# Altium schematic sheet Power-Management.SchDoc: Power Management
size OrCAD B; DrawnBy: Fred Vatnsdal
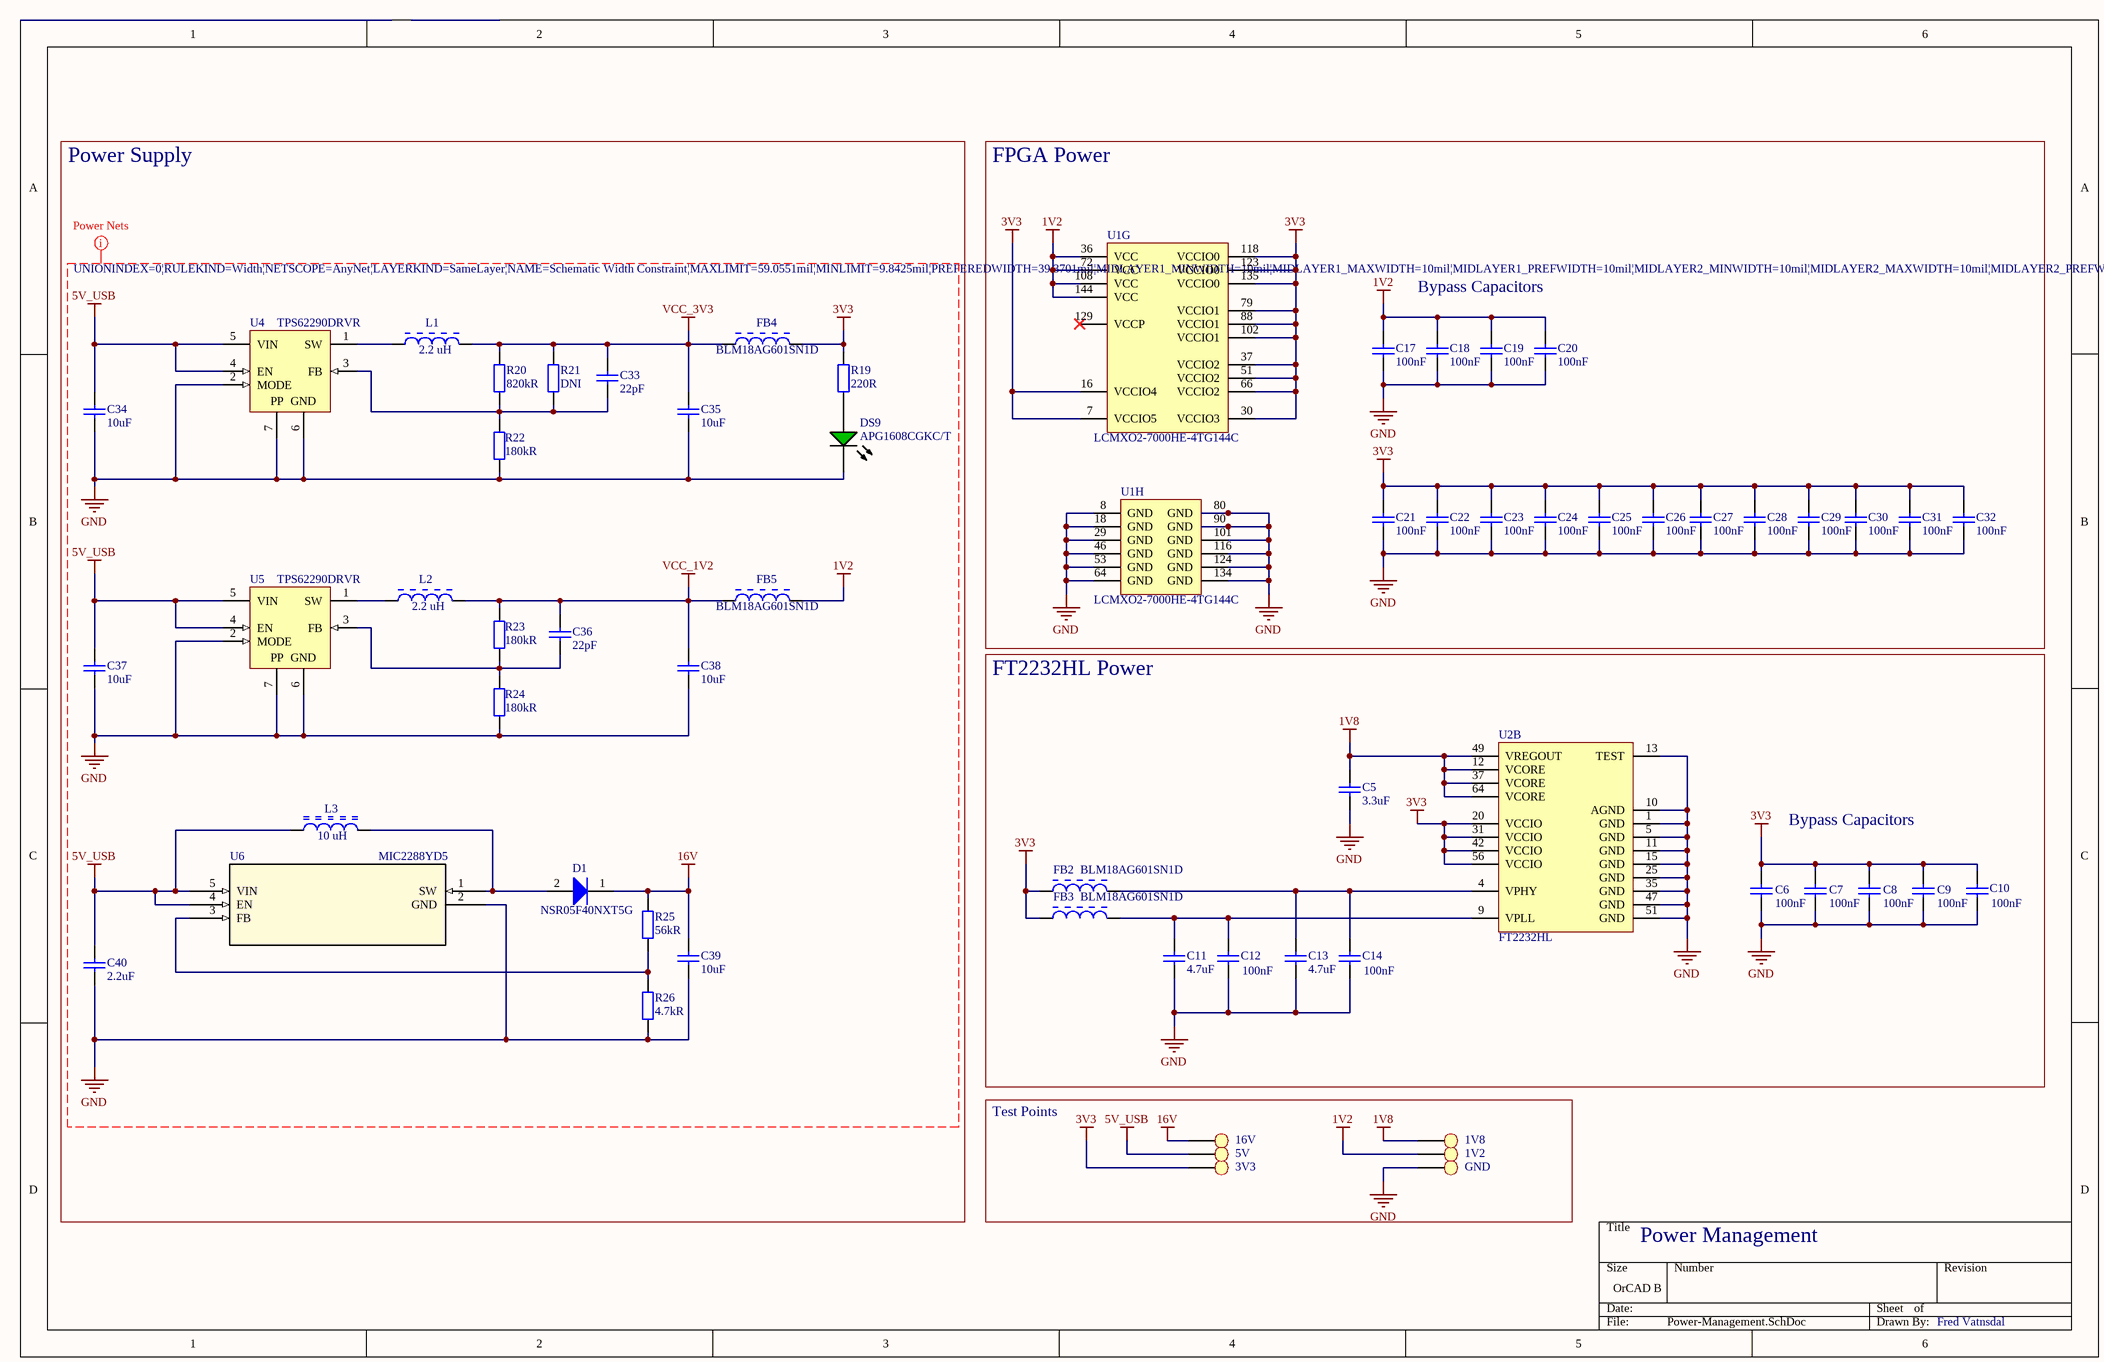
[diagram p0: Power-Management.SchDoc]

## Parts
1V2  TP  [TP_0.75DIA]  (value not drawn)
1V8  TP  [TP_0.75DIA]  (value not drawn)
3V3  TP  [TP_0.75DIA]  (value not drawn)
5V  TP  [TP_0.75DIA]  (value not drawn)
16V  TP  [TP_0.75DIA]  (value not drawn)
C5  Capacitance: 3.3uF  [CAP_0603_imperial]  (hidden comment: CAP 3.3uF 10V 0603(1608))
C6  Capacitance: 100nF  [CAP_0402_imperial]  (hidden comment: C0402C104K4RAC-TU)
C7  Capacitance: 100nF  [CAP_0402_imperial]  (hidden comment: C0402C104K4RACTU)
C8  Capacitance: 100nF  [CAP_0402_imperial]  (hidden comment: C0402C104K4RACTU)
C9  Capacitance: 100nF  [CAP_0402_imperial]  (hidden comment: C0402C104K4RACTU)
C10  Capacitance: 100nF  [CAP_0402_imperial]  (hidden comment: C0402C104K4RACTU)
C11  Capacitance: 4.7uF  [CAP_0603_imperial]  (hidden comment: CAP 4.7uF 10V 0805(2012))
C12  Capacitance: 100nF  [CAP_0402_imperial]  (hidden comment: C0402C104K4RACTU)
C13  Capacitance: 4.7uF  [CAP_0603_imperial]  (hidden comment: CAP 4.7uF 10V 0805(2012))
C14  Capacitance: 100nF  [CAP_0402_imperial]  (hidden comment: C0402C104K4RACTU)
C17  Capacitance: 100nF  [CAP_0402_imperial]  (hidden comment: C0402C104K4RACTU)
C18  Capacitance: 100nF  [CAP_0402_imperial]  (hidden comment: C0402C104K4RACTU)
C19  Capacitance: 100nF  [CAP_0402_imperial]  (hidden comment: C0402C104K4RACTU)
C20  Capacitance: 100nF  [CAP_0402_imperial]  (hidden comment: C0402C104K4RACTU)
C21  Capacitance: 100nF  [CAP_0402_imperial]  (hidden comment: C0402C104K4RACTU)
C22  Capacitance: 100nF  [CAP_0402_imperial]  (hidden comment: C0402C104K4RACTU)
C23  Capacitance: 100nF  [CAP_0402_imperial]  (hidden comment: C0402C104K4RACTU)
C24  Capacitance: 100nF  [CAP_0402_imperial]  (hidden comment: C0402C104K4RACTU)
C25  Capacitance: 100nF  [CAP_0402_imperial]  (hidden comment: C0402C104K4RACTU)
C26  Capacitance: 100nF  [CAP_0402_imperial]  (hidden comment: C0402C104K4RACTU)
C27  Capacitance: 100nF  [CAP_0402_imperial]  (hidden comment: C0402C104K4RACTU)
C28  Capacitance: 100nF  [CAP_0402_imperial]  (hidden comment: C0402C104K4RACTU)
C29  Capacitance: 100nF  [CAP_0402_imperial]  (hidden comment: C0402C104K4RACTU)
C30  Capacitance: 100nF  [CAP_0402_imperial]  (hidden comment: C0402C104K4RACTU)
C31  Capacitance: 100nF  [CAP_0402_imperial]  (hidden comment: C0402C104K4RACTU)
C32  Capacitance: 100nF  [CAP_0402_imperial]  (hidden comment: C0402C104K4RACTU)
C33  Capacitance: 22pF  [CAP_0603_imperial]  (hidden comment: 06035A220JAT2A)
C34  Capacitance: 10uF  [CAP_0603_imperial]  (hidden comment: GRM31CR61E106KA12L)
C35  Capacitance: 10uF  [CAP_0603_imperial]  (hidden comment: GRM31CR61E106KA12L)
C36  Capacitance: 22pF  [CAP_0603_imperial]  (hidden comment: 06035A220JAT2A)
C37  Capacitance: 10uF  [CAP_0603_imperial]  (hidden comment: GRM31CR61E106KA12L)
C38  Capacitance: 10uF  [CAP_0603_imperial]  (hidden comment: GRM31CR61E106KA12L)
C39  Capacitance: 10uF  [CAP_0603_imperial]  (hidden comment: GRM31CR61E106KA12L)
C40  Capacitance: 2.2uF  [CAP_0603_imperial]  (hidden comment: GRM188R61A225KE34x)
D1  NSR05F40NXT5G  [ONSC-DSN-2-152AC-01_V]
DS9  APG1608CGKC/T  [KING-LED0603-25-GREEN_V]
FB2  BLM18AG601SN1D  [MURA-BLM18-F-H1-CHIP-2_V]
FB3  BLM18AG601SN1D  [MURA-BLM18-F-H1-CHIP-2_V]
FB4  BLM18AG601SN1D  [MURA-BLM18-F-H1-CHIP-2_V]
FB5  BLM18AG601SN1D  [MURA-BLM18-F-H1-CHIP-2_V]
GND  TP  [TP_0.75DIA]  (value not drawn)
L1  Inductance: 2.2 uH  [BOUR-SRN3015-2_V]  (hidden comment: SRN3015-2R2M)
L2  Inductance: 2.2 uH  [BOUR-SRN3015-2_V]  (hidden comment: SRN3015-2R2M)
L3  Inductance: 10 uH  [BOUR-CM322522_V]  (hidden comment: CM322522-100KL)
R19  Resistance: 220R  [RES_0603_imperial]  (hidden comment: 220R 1% 0603(1608))
R20  Resistance: 820kR  [RES_0603_imperial]  (hidden comment: 820K 1% 0603(1608))
R21  Resistance: DNI  [RES_0603_imperial]  (hidden comment: 820K 1% 0603(1608))
R22  Resistance: 180kR  [RES_0603_imperial]  (hidden comment: 180K 1% 0603(1608))
R23  Resistance: 180kR  [RES_0603_imperial]  (hidden comment: 180K 1% 0603(1608))
R24  Resistance: 180kR  [RES_0603_imperial]  (hidden comment: 180K 1% 0603(1608))
R25  Resistance: 56kR  [RES_0603_imperial]  (hidden comment: 56K 1% 0603(1608))
R26  Resistance: 4.7kR  [RES_0603_imperial]  (hidden comment: 4K7 1% 0603(1608))
U1  LCMXO2-7000HE-4TG144C  [TQFP144_L]  (parts G,H of 8)
U2  FT2232HL  [FTDI-LQFP-64_L]  (part B of 2)
U4  TPS62290DRVR  [DRV6-1600X1000TP]
U5  TPS62290DRVR  [DRV6-1600X1000TP]
U6  MIC2288YD5  [TSOT-23-5_D5]

## Blocks framed on the sheet
Power Supply: C33-C40 D1 DS9 FB4 FB5 L1-L3 R19-R26 U4-U6
FPGA Power: C17-C32 U1
FT2232HL Power: C5-C14 FB2 FB3 U2
Test Points: 1V2 1V8 3V3 5V 16V GND

## Nets
1V2: 1V2.1 C17.1 C18.1 C19.1 C20.1 FB5.2 U1.36(VCC) U1.72(VCC) U1.108(VCC) U1.144(VCC)
1V8: 1V8.1 C5.1 U2.12(VCORE) U2.37(VCORE) U2.49(VREGOUT) U2.64(VCORE)
3V3: 3V3.1 C6.1 C7.1 C8.1 C9.1 C10.1 C21.1 C22.1 C23.1 C24.1 C25.1 C26.1 C27.1 C28.1 C29.1 C30.1 C31.1 C32.1 FB2.1 FB3.1 FB4.2 R19.2 U1.7(VCCIO5) U1.16(VCCIO4) U1.30(VCCIO3) U1.37(VCCIO2) U1.51(VCCIO2) U1.66(VCCIO2) U1.79(VCCIO1) U1.88(VCCIO1) U1.102(VCCIO1) U1.118(VCCIO0) U1.123(VCCIO0) U1.135(VCCIO0) U2.20(VCCIO) U2.31(VCCIO) U2.42(VCCIO) U2.56(VCCIO)
5V_USB: 5V.1 C34.1 C37.1 C40.1 L3.1 U4.4(EN) U4.5(VIN) U5.4(EN) U5.5(VIN) U6.4(EN) U6.5(VIN)
16V: 16V.1 C39.1 D1.1(K) R25.2
GND: C5.2 C6.2 C7.2 C8.2 C9.2 C10.2 C11.2 C12.2 C13.2 C14.2 C17.2 C18.2 C19.2 C20.2 C21.2 C22.2 C23.2 C24.2 C25.2 C26.2 C27.2 C28.2 C29.2 C30.2 C31.2 C32.2 C34.2 C35.2 C37.2 C38.2 C39.2 C40.2 DS9.2(K) GND.1 R22.1 R24.1 R26.1 U1.8(GND) U1.18(GND) U1.29(GND) U1.46(GND) U1.53(GND) U1.64(GND) U1.80(GND) U1.90(GND) U1.101(GND) U1.116(GND) U1.124(GND) U1.134(GND) U2.1(GND) U2.5(GND) U2.10(AGND) U2.11(GND) U2.13(TEST) U2.15(GND) U2.25(GND) U2.35(GND) U2.47(GND) U2.51(GND) U4.2(MODE) U4.6(GND) U4.7(PP) U5.2(MODE) U5.6(GND) U5.7(PP) U6.2(GND)
VCC_1V2: C36.1 C38.1 FB5.1 L2.2 R23.2
VCC_3V3: C33.1 C35.1 FB4.1 L1.2 R20.2 R21.2
NetC11_1: C11.1 C12.1 FB3.2 U2.9(VPLL)
NetC13_1: C13.1 C14.1 FB2.2 U2.4(VPHY)
NetC33_2: C33.2 R20.1 R21.1 R22.2 U4.3(FB)
NetC36_2: C36.2 R23.1 R24.2 U5.3(FB)
NetD1_2: D1.2(A) L3.2 U6.1(SW)
NetDS9_1: DS9.1(A) R19.1
NetL1_1: L1.1 U4.1(SW)
NetL2_1: L2.1 U5.1(SW)
NetR25_1: R25.1 R26.2 U6.3(FB)

Not connected (* = marked no-connect by the designer): U1 129(VCCP)*

## Layout directives
net class Power; rule Width Constraint [Pref Width = 1mm    Min Width = 0.25mm    Max Width = 1.5mm]: 1V2, 3V3, 5V_USB, 16V, GND, VCC_1V2, VCC_3V3

## Notes on the sheet
- Bypass Capacitors

## Library data of the parts
C5 = C0603C335M9PACTU: CAP CER 3.3UF 6.3V X5R 0603; Manufacturer: KEMET; Tolerance: 20%; Dielectric Material: Ceramic; Dissipation Factor: 5%; Supplier 1: Digi-Key; Manufacturer Part Number: C0603C335M9PACTU; Stock 1: 0; Pricing 1: 1=0.28, 10=0.194, 100=0.0983, 500=0.06728, 1000=0.05951 (USD); Mount: Surface Mount,PCB; Case/Package: 0603; Number of Pins: 2; Case Code (Metric): 1608; Case Code (Imperial): 0603; Min Operating Temperature: -55°C; Max Operating Temperature: 85°C; Voltage Rating: 6.3V; Voltage Rating (DC): 6.3V; Packaging: Tape and Reel; Package Quantity: 1; Dielectric: X5R; Termination: SMD/SMT; Voltage: 6.3V; Length: 1.6mm; Height: 0.8mm; Width: 0.031inch; Thickness: 0.035inch; Depth: 0.8mm; Radiation Hardening: No; Lead Free: Lead Free; REACH SVHC: No SVHC; ComponentLink1URL: https://datasheet.ciiva.com/7823/1732705-7823760.pdf; ComponentLink1Description: https://datasheet.ciiva.com/7823/1732705-7823760.pdf; ComponentLink2URL: https://datasheet.ciiva.com/146/docfinderpartnumber-c0603c335m9pactu-146661.pdf; ComponentLink2Description: https://datasheet.ciiva.com/146/docfinderpartnumber-c0603c335m9pactu-146661.pdf; Supplier Part Number 1: 399-5502-6-ND
C6-C10 C12 C14 C17-C32 = C0402C104K4RAC-TU: CAP CER 0.1UF 16V X7R 0402; Manufacturer: KEMET; Dielectric Material: Ceramic; Dissipation Factor: 3.5%; Tolerance: 10%; Supplier 1: Digi-Key; Manufacturer Part Number: C0402C104K4RAC-TU; Stock 1: 0; Mount: Surface Mount,PCB; Case/Package: 0402; Number of Pins: 2; Case Code (Metric): 1005; Case Code (Imperial): 0402; Contact Plating: Tin,Matte; Min Operating Temperature: -55°C; Max Operating Temperature: 125°C; Packaging: Tape and Reel; Voltage Rating (DC): 16V; Dielectric: X7R; Voltage Rating: 16V; Package Quantity: 1; Termination: SMD/SMT; Length: 1mm; Height: 0.5mm; Width: 0.02inch; Depth: 0.5mm; Thickness: 0.022inch; Lead Pitch: 0.3mm; Radiation Hardening: No; REACH SVHC: No SVHC; ComponentLink1URL: https://datasheet.ciiva.com/28645/1851736-28645381.pdf; ComponentLink1Description: https://datasheet.ciiva.com/28645/1851736-28645381.pdf; ComponentLink2URL: https://datasheet.ciiva.com/5418/kem-c1002-x7r-smd-5418136.pdf; ComponentLink2Description: https://datasheet.ciiva.com/5418/kem-c1002-x7r-smd-5418136.pdf; ComponentLink3URL: https://datasheet.ciiva.com/14586/70095383-14586056.pdf; ComponentLink3Description: https://datasheet.ciiva.com/14586/70095383-14586056.pdf; ComponentLink4URL: https://datasheet.ciiva.com/18100/getdatasheetpartid-37082-18100986.pdf; ComponentLink4Description: https://datasheet.ciiva.com/18100/getdatasheetpartid-37082-18100986.pdf; ComponentLink5URL: https://datasheet.ciiva.com/14603/70095383-14603039.pdf; ComponentLink5Description: https://datasheet.ciiva.com/14603/70095383-14603039.pdf; Supplier Part Number 1: 399-3521-6-ND; Voltage: 16V
C11 C13 = GRM188R61E475KE11D: 4.7µF ±10% 25V X5R Ceramic Capacitor -55°C ~ 85°C Surface Mount, MLCC 0603 (1608 Metric) 0.063" L x 0.031" W (1.60mm x 0.80mm); Manufacturer: Murata; Tolerance: 10%; Supplier 1: Digi-Key; Manufacturer Part Number: GRM188R61E475KE11D; Stock 1: 25738; Pricing 1: 1=0.46, 10=0.323, 100=0.1937, 500=0.14524, 1000=0.12265 (USD); Mount: Surface Mount; Case/Package: 0603; Case Code (Metric): 1608; Case Code (Imperial): 0603; Material: Ceramic; Min Operating Temperature: -55°C; Max Operating Temperature: 85°C; Package Quantity: 4000; Packaging: Cut Tape; Voltage Rating: 25V; Dielectric: X5R; Voltage Rating (DC): 25V; Voltage: 25V; Length: 1.6mm; Height: 0.8mm; Width: 0.031inch; Thickness: 0.031inch; Depth: 0.8mm; REACH SVHC: No SVHC; Lead Free: Lead Free; ComponentLink1URL: https://datasheet.ciiva.com/46444/1769893-46444982.pdf; ComponentLink1Description: https://datasheet.ciiva.com/46444/1769893-46444982.pdf; ComponentLink2URL: https://datasheet.ciiva.com/46444/1769893-46444983.pdf; ComponentLink2Description: https://datasheet.ciiva.com/46444/1769893-46444983.pdf; ComponentLink3URL: https://datasheet.ciiva.com/14891/partnumbering-e-01-14891102.pdf; ComponentLink3Description: https://datasheet.ciiva.com/14891/partnumbering-e-01-14891102.pdf; ComponentLink4URL: https://datasheet.ciiva.com/14891/partnumbering-e-01-14891103.pdf; ComponentLink4Description: https://datasheet.ciiva.com/14891/partnumbering-e-01-14891103.pdf; Supplier Part Number 1: 490-7203-6-ND
C33 C36 = C1608C0G1H220J080AA: CAP CER 22PF 50V C0G 0603; Manufacturer: TDK; Dielectric Material: Ceramic; Tolerance: 5%; Temperature Coefficient: 30ppm/°C; Dielectric: C0G; Supplier 1: Digi-Key; Manufacturer Part Number: C1608C0G1H220J080AA; Stock 1: 0; Pricing 1: 1=0.12, 10=0.089, 100=0.0394, 500=0.02818, 1000=0.02214 (USD); Mount: Surface Mount; Case/Package: 0603; Number of Pins: 2; Weight: 7.1E-05oz; Case Code (Metric): 1608; Case Code (Imperial): 0603; Min Operating Temperature: -55°C; Max Operating Temperature: 125°C; Packaging: Tape and Reel; Voltage Rating: 50V; Package Quantity: 1; Termination: SMD/SMT; Voltage: 50V; Voltage Rating (DC): 50V; Length: 1.6mm; Height: 0.8mm; Width: 0.031inch; Depth: 0.8mm; Thickness: 0.037inch; Radiation Hardening: No; REACH SVHC: Unknown; Lead Free: Lead Free; ComponentLink1URL: https://datasheet.ciiva.com/6293/tdkmlcccaprange-6293701.pdf; ComponentLink1Description: https://datasheet.ciiva.com/6293/tdkmlcccaprange-6293701.pdf; ComponentLink2URL: https://datasheet.ciiva.com/17487/e412-c-17487461.pdf; ComponentLink2Description: https://datasheet.ciiva.com/17487/e412-c-17487461.pdf; ComponentLink3URL: https://datasheet.ciiva.com/22694/1796654-22694102.pdf; ComponentLink3Description: https://datasheet.ciiva.com/22694/1796654-22694102.pdf; ComponentLink4URL: https://datasheet.ciiva.com/6293/tdkmlcccaprange-6293704.pdf; ComponentLink4Description: https://datasheet.ciiva.com/6293/tdkmlcccaprange-6293704.pdf; ComponentLink5URL: https://datasheet.ciiva.com/24218/c1608c0g1h220j080aa-264689-24218568.pdf; ComponentLink5Description: https://datasheet.ciiva.com/24218/c1608c0g1h220j080aa-264689-24218568.pdf; ComponentLink6URL: https://datasheet.ciiva.com/28576/1744655-28576921.pdf; ComponentLink6Description: https://datasheet.ciiva.com/28576/1744655-28576921.pdf; ComponentLink7URL: https://datasheet.ciiva.com/7975/1796654-7975034.pdf; ComponentLink7Description: https://datasheet.ciiva.com/7975/1796654-7975034.pdf; ComponentLink8URL: https://datasheet.ciiva.com/26946/getdatasheetpartid-741952-26946507.pdf; ComponentLink8Description: https://datasheet.ciiva.com/26946/getdatasheetpartid-741952-26946507.pdf; ComponentLink9URL: https://datasheet.ciiva.com/6293/tdkmlcccaprange-6293708.pdf; ComponentLink9Description: https://datasheet.ciiva.com/6293/tdkmlcccaprange-6293708.pdf; Supplier Part Number 1: 445-1273-6-ND
C34 C35 C37-C39 = LMK107BJ106MALTD: CAP CER 10UF 10V X5R 0603; Manufacturer: Taiyo Yuden; Tolerance: 20%; Packaging: Tape and Reel; Dielectric: X5R; Supplier 1: Digi-Key; Manufacturer Part Number: LMK107BJ106MALTD; Stock 1: 40000; Pricing 1: 1=0.62, 10=0.431, 100=0.2588, 500=0.19406, 1000=0.16388 (USD); Mount: Surface Mount; Case/Package: 0603; Number of Pins: 2; Case Code (Metric): 1608; Case Code (Imperial): 0603; Min Operating Temperature: -55°C; Max Operating Temperature: 85°C; Package Quantity: 4000; Voltage Rating (DC): 10V; Termination: SMD/SMT; Composition: Ceramic; Length: 1.6mm; Height: 0.8mm; Width: 0.031inch; Thickness: 0.035inch; REACH SVHC: Unknown; Lead Free: Lead Free; ComponentLink1URL: https://datasheet.ciiva.com/140/mlcc-all-e-140192.pdf; ComponentLink1Description: https://datasheet.ciiva.com/140/mlcc-all-e-140192.pdf; ComponentLink2URL: https://datasheet.ciiva.com/140/mlcc-all-e-140193.pdf; ComponentLink2Description: https://datasheet.ciiva.com/140/mlcc-all-e-140193.pdf; ComponentLink3URL: https://datasheet.ciiva.com/22694/1784412-22694257.pdf; ComponentLink3Description: https://datasheet.ciiva.com/22694/1784412-22694257.pdf; ComponentLink4URL: https://datasheet.ciiva.com/140/mlcc-all-e-140194.pdf; ComponentLink4Description: https://datasheet.ciiva.com/140/mlcc-all-e-140194.pdf; ComponentLink5URL: https://datasheet.ciiva.com/15921/288lmk107bbj106malt-15921300.pdf; ComponentLink5Description: https://datasheet.ciiva.com/15921/288lmk107bbj106malt-15921300.pdf; ComponentLink6URL: https://datasheet.ciiva.com/7975/1784412-7975562.pdf; ComponentLink6Description: https://datasheet.ciiva.com/7975/1784412-7975562.pdf; ComponentLink7URL: https://datasheet.ciiva.com/5414/mlcc-all-e-541559-5414109.pdf; ComponentLink7Description: https://datasheet.ciiva.com/5414/mlcc-all-e-541559-5414109.pdf; ComponentLink8URL: https://datasheet.ciiva.com/7975/mlcc-all-e-7975775.pdf; ComponentLink8Description: https://datasheet.ciiva.com/7975/mlcc-all-e-7975775.pdf; Supplier Part Number 1: 587-2562-6-ND; Voltage Rating: 10V
C40 = GRM188R71A225KE15D: CAP CER 2.2UF 10V X7R 0603; Manufacturer: Murata; Tolerance: 10%; Material: Ceramic; Width: 0.031inch; Case/Package: 0603; Length: 1.6mm; Package Quantity: 1; Case Code (Imperial): 0603; Packaging: Cut Tape; Case Code (Metric): 1608; ComponentLink1Description: https://datasheet.ciiva.com/138/product-138560.pdf; Height: 0.8mm; ComponentLink2URL: https://datasheet.ciiva.com/138/grm188r71a225ke15-01-138561.pdf; ComponentLink2Description: https://datasheet.ciiva.com/138/grm188r71a225ke15-01-138561.pdf; Max Operating Temperature: 125°C; Min Operating Temperature: -55°C; ComponentLink1URL: https://datasheet.ciiva.com/138/product-138560.pdf; Supplier 1: Digi-Key; Manufacturer Part Number: GRM188R71A225KE15D; Stock 1: 0; Pricing 1: 1=0.45, 10=0.313, 100=0.188, 500=0.14102, 1000=0.11908 (USD); Mount: Surface Mount; Number of Pins: 2; Weight: 7.1E-05oz; Voltage Rating: 10V; Voltage Rating (DC): 10V; Dielectric: X7R; Termination: SMD/SMT; Voltage: 10V; Thickness: 0.035inch; Depth: 0.8mm; REACH SVHC: No SVHC; Lead Free: Lead Free; ComponentLink3URL: https://datasheet.ciiva.com/3778/302grm188r71a225ke1523-3778402.pdf; ComponentLink3Description: https://datasheet.ciiva.com/3778/302grm188r71a225ke1523-3778402.pdf; ComponentLink4URL: https://datasheet.ciiva.com/22703/1697709-22703330.pdf; ComponentLink4Description: https://datasheet.ciiva.com/22703/1697709-22703330.pdf; ComponentLink5URL: https://datasheet.ciiva.com/16389/product-16389723.pdf; ComponentLink5Description: https://datasheet.ciiva.com/16389/product-16389723.pdf; ComponentLink6URL: https://datasheet.ciiva.com/11789/0900766b80ef921d-11789118.pdf; ComponentLink6Description: https://datasheet.ciiva.com/11789/0900766b80ef921d-11789118.pdf; ComponentLink7URL: https://datasheet.ciiva.com/138/grm188r71a225ke15-01-138559.pdf; ComponentLink7Description: https://datasheet.ciiva.com/138/grm188r71a225ke15-01-138559.pdf; ComponentLink8URL: https://datasheet.ciiva.com/29199/454488-da-01-en-vs-kondensator-0603-29199701.pdf; ComponentLink8Description: https://datasheet.ciiva.com/29199/454488-da-01-en-vs-kondensator-0603-29199701.pdf; Supplier Part Number 1: 490-4520-6-ND
D1 = CMP-1055-00232-1: Schottky Barrier Diode, 2-Pin DSN, Pb-Free, Tape and Reel; Manufacturer: On Semiconductor; IFSM Max (A): 10; Configuration: Single; RoHS: TRUE; PackageVersion: Rev. C, 01/2011; ComponentLink3Description: Package Specification; ComponentLink3URL: http://www.onsemi.cn/pub_link/Collateral/152AC.PDF; PackageDescription: 2-Pin Micro Molded Package, Body 1 x 0.6 mm; ComponentLink1URL: http://www.onsemi.com/; ComponentLink1Description: Manufacturer URL; Mounting Technology: Surface Mount; Packing: Tape and Reel; PackageReference: DSN-2-152AC-01; ComponentLink2Description: Datasheet; DatasheetVersion: Rev. 3; ComponentLink2URL: http://www.onsemi.cn/pub_link/Collateral/NSR05F40.PDF; PartNumber: NSR05F40NXT5G
DS9 = CMP-0239-00001-1: LED, SMT, 0603(1608), 0.25mm Thickness, Green; Forward Current: 30 mA; Reverse Voltage: 5 V; Power Dissipation: 78 mW; Packing: Reel; ComponentLink1Description: Manufacturer URL; ComponentLink1URL: http://www.kingbrightusa.com/; ComponentLink2URL: http://www.kingbrightusa.com/images/catalog/SPEC/APG1608CGKC-T.pdf; Mounting Technology: Surface Mount; Storage Temperature: -40 to 85 degC; DatasheetVersion: Rev. 5B, 10/2012; PartNumber: APG1608CGKC/T; PackageReference: LED0603-25-GREEN; ComponentLink2Description: Datasheet; PackageDescription: 2-Pin SMT LED, 1.6 x 0.8 mm Body, 0.25mm Thickness; PackageVersion: Rev. 5B, 10/2012
FB2-FB5 = CMP-0686-00436-2: Chip Ferrite Bead for General Use, 600 Ohm, 500 mA, -55 to 125 degC, 1.6 x 0.8 x 0.95 mm SMD, Tape and Reel; Manufacturer: Murata; DC Resistance: 0.38 Ohm Max.; Impedance (at 100 MHz): 600 Ohm +/- 25%; Rated Current: 500 mA; ComponentLink3Description: Package Specification; ComponentLink1Description: Manufacturer URL; ComponentLink1URL: http://www.murata.com/; DatasheetVersion: 08/2013; ComponentLink2URL: http://www.murata.com/products/catalog/pdf/c31e.pdf; PackageReference: BLM18_H950-2; PackageDescription: 2-Pin Chip, Body 1.6 x 0.8 mm; PartNumber: BLM18AG601SN1D; Mounting Technology: Surface Mount; ComponentLink2Description: Datasheet; Packing: Tape and Reel; ComponentLink3URL: http://www.murata.com/products/catalog/pdf/c31e.pdf; Operating Temperature Range: -55 to 125 degC
L1 L2 = CMP-0007-00003-1: Semi-shielded Power Inductor, 2.2 uH, +/- 20%, 1.8 A, -40 to 125 degC, 3 x 3 x 1.5 mm SMD, RoHS and Halogen Free, Tape and Reel; Manufacturer: Bourns; Isat: 1.65 A; Rated current: 1.8 A; Inductance tolerance: +/- 20%; DCR Max: 0.072 Ohm; SRF Min: 90 MHz; Resistance to Solder Heat: +260 degC for 10 sec.; Operating Temperature: -40 to 125 degC; PartNumber: SRN3015-2R2M; Packing: Tape and Reel; ComponentLink3Description: Package Specification; ComponentLink2Description: Datasheet; RoHS: TRUE; ComponentLink3URL: http://www.bourns.com/data/global/pdfs/SRN3015.pdf; PackageDescription: 2-Pin SMD, Body 3 x 3 mm, Height 1.5 mm; ComponentLink1URL: http://www.bourns.com/; ComponentLink1Description: Manufacturer URL; DatasheetVersion: Aug-11; Mounting Technology: Surface Mount; ComponentLink2URL: http://www.bourns.com/data/global/pdfs/SRN3015.pdf; PackageReference: SRN3015
L3 = CMP-1747-00008-1: Chip Inductor / , 10 uH, +/- 10%, -40 to 125 degC, 1210 (3225 Metric), RoHS, Tape and Reel; Current Rating: 1.5 A; Colour: White; Gender: Female; Connector Type: USB; Min Operating Temperature: -55 degC; ComponentLink2Description: Datasheet; Packaging: Tray; Contact Material: Bronze; ComponentLink1Description: Manufacturer URL; PackageDescription: 2-Pin Surface Mount Device, Body 3.2 x 2.5 mm; Contact Plating: Gold; Max Operating Temperature: 85 degC; ComponentLink2URL: http://www.bourns.com/docs/Product-Datasheets/cm322522.pdf; PackageReference: 1210; Radiation Hardening: No; DatasheetVersion: Aug-14; Package Quantity: 100; Pins: 4; Mount: Through Hole; Lead Pitch: 2.5 mm; ComponentLink1URL: http://www.bourns.com/; Height: 15.9 mm; RoHSCompliant: true; Width: 11.15 mm
R19 = ERA-3AEB221V: Res Thin Film 0603 220 Ohm 0.1% 1/10W ±25ppm/C Molded SMD Punched Carrier T/R; Manufacturer: Panasonic; Voltage Rating: 75V; Temperature Coefficient: 25ppm/°C; Power Rating: 100mW; Tolerance: 0.1%; Supplier 1: Digi-Key; Manufacturer Part Number: ERA-3AEB221V; Stock 1: 240; Pricing 1: 1=0.41, 10=0.346, 100=0.1351, 1000=0.05655, 2500=0.05184 (USD); Mount: Surface Mount; Case/Package: 0603; Number of Pins: 2; Case Code (Metric): 1608; Case Code (Imperial): 0603; Contact Plating: Tin; Min Operating Temperature: -55°C; Max Operating Temperature: 155°C; Packaging: Tape and Reel; Package Quantity: 1; Termination: SMD/SMT; Voltage Rating (DC): 75V; Military Standard: Not; Max Power Dissipation: 100mW; Composition: Metal Film,Thin Film; Number of Terminations: 2; Features: Automotive AEC-Q200; Length: 1.6mm; Height: 0.45mm; Width: 0.8mm; Depth: 0.8mm; Radiation Hardening: No; REACH SVHC: No SVHC; Lead Free: Lead Free; ComponentLink1URL: https://datasheet.ciiva.com/30089/54aoa0000ce26-30089206.pdf; ComponentLink1Description: https://datasheet.ciiva.com/30089/54aoa0000ce26-30089206.pdf; ComponentLink2URL: https://datasheet.ciiva.com/11808/0900766b80fe20f7-11808055.pdf; ComponentLink2Description: https://datasheet.ciiva.com/11808/0900766b80fe20f7-11808055.pdf; ComponentLink3URL: https://datasheet.ciiva.com/48530/era-eng-tds-48530567.pdf; ComponentLink3Description: https://datasheet.ciiva.com/48530/era-eng-tds-48530567.pdf; ComponentLink4URL: https://datasheet.ciiva.com/9117/aoa0000ce26-9117624.pdf; ComponentLink4Description: https://datasheet.ciiva.com/9117/aoa0000ce26-9117624.pdf; ComponentLink5URL: https://datasheet.ciiva.com/22739/485442-22739289.pdf; ComponentLink5Description: https://datasheet.ciiva.com/22739/485442-22739289.pdf; ComponentLink6URL: https://datasheet.ciiva.com/7886/485442-7886586.pdf; ComponentLink6Description: https://datasheet.ciiva.com/7886/485442-7886586.pdf; ComponentLink7URL: https://datasheet.ciiva.com/9184/aoa0000ce26-9184316.pdf; ComponentLink7Description: https://datasheet.ciiva.com/9184/aoa0000ce26-9184316.pdf; ComponentLink8URL: https://datasheet.ciiva.com/43455/485442-43455212.pdf; ComponentLink8Description: https://datasheet.ciiva.com/43455/485442-43455212.pdf; ComponentLink9URL: https://datasheet.ciiva.com/6000/485442-6000910.pdf; ComponentLink9Description: https://datasheet.ciiva.com/6000/485442-6000910.pdf; ComponentLink10URL: https://datasheet.ciiva.com/17206/aoa0000ce26-17206814.pdf; ComponentLink10Description: https://datasheet.ciiva.com/17206/aoa0000ce26-17206814.pdf; ComponentLink11URL: https://datasheet.ciiva.com/48425/era-eng-tds-48425439.pdf; ComponentLink11Description: https://datasheet.ciiva.com/48425/era-eng-tds-48425439.pdf; ComponentLink12URL: https://datasheet.ciiva.com/29183/450451-da-01-en-widerstand-0603-era-29183676.pdf; ComponentLink12Description: https://datasheet.ciiva.com/29183/450451-da-01-en-widerstand-0603-era-29183676.pdf; Supplier Part Number 1: P220DBDKR-ND
R20 R21 = ERJ-3EKF8203V: RESISTOR, 0603, 0.1W, 1%, 820K; Manufacturer: Panasonic; Power Rating: 100mW; Voltage Rating: 75V; Temperature Coefficient: 100ppm/°C; Tolerance: 1%; Supplier 1: Digi-Key; Manufacturer Part Number: ERJ-3EKF8203V; Stock 1: 143016; Pricing 1: 1=0.1, 10=0.079, 100=0.0323, 1000=0.01449, 2500=0.01258 (USD); Mount: Surface Mount; Case/Package: 0603; Number of Pins: 2; Weight: 7.1E-05oz; Case Code (Metric): 1608; Case Code (Imperial): 0603; Contact Plating: Tin; Min Operating Temperature: -55°C; Max Operating Temperature: 155°C; Packaging: Tape and Reel; Composition: Thick Film; Voltage Rating (DC): 75V; Termination: SMD/SMT; Package Quantity: 1; Number of Terminations: 2; Military Standard: Not; Max Power Dissipation: 100mW; Features: Automotive AEC-Q200; Length: 1.6mm; Height: 0.022inch; Width: 0.031inch; Depth: 0.8mm; REACH SVHC: Yes; ComponentLink1URL: https://datasheet.ciiva.com/22681/1678782-22681190.pdf; ComponentLink1Description: https://datasheet.ciiva.com/22681/1678782-22681190.pdf; ComponentLink2URL: https://datasheet.ciiva.com/9179/aoa0000ce2-9179848.pdf; ComponentLink2Description: https://datasheet.ciiva.com/9179/aoa0000ce2-9179848.pdf; ComponentLink3URL: https://datasheet.ciiva.com/30211/aoa0000ce2-30211400.pdf; ComponentLink3Description: https://datasheet.ciiva.com/30211/aoa0000ce2-30211400.pdf; ComponentLink4URL: https://datasheet.ciiva.com/22687/426256-22687466.pdf; ComponentLink4Description: https://datasheet.ciiva.com/22687/426256-22687466.pdf; ComponentLink5URL: https://datasheet.ciiva.com/24124/aoa0000ce2-24124218.pdf; ComponentLink5Description: https://datasheet.ciiva.com/24124/aoa0000ce2-24124218.pdf; ComponentLink6URL: https://datasheet.ciiva.com/7710/aoa0000ce2-7710765.pdf; ComponentLink6Description: https://datasheet.ciiva.com/7710/aoa0000ce2-7710765.pdf; ComponentLink7URL: https://datasheet.ciiva.com/9179/aoa0000ce2-9179854.pdf; ComponentLink7Description: https://datasheet.ciiva.com/9179/aoa0000ce2-9179854.pdf; ComponentLink8URL: https://datasheet.ciiva.com/16781/70260748-16781326.pdf; ComponentLink8Description: https://datasheet.ciiva.com/16781/70260748-16781326.pdf; Supplier Part Number 1: P820KHCT-ND
R22-R24 = ERA-3AEB184V: RESISTOR, 0603, 180K, 0.1%, 0.1W; Manufacturer: Panasonic; Power Rating: 100mW; Voltage Rating: 75V; Temperature Coefficient: 25ppm/°C; Tolerance: 0.1%; Supplier 1: Digi-Key; Manufacturer Part Number: ERA-3AEB184V; Stock 1: 101770; Pricing 1: 1=0.41, 10=0.346, 100=0.1351, 1000=0.05655, 2500=0.05184 (USD); Mount: Surface Mount; Case/Package: 0603; Number of Pins: 2; Case Code (Metric): 1608; Case Code (Imperial): 0603; Contact Plating: Tin; Min Operating Temperature: -55°C; Max Operating Temperature: 155°C; Packaging: Tape and Reel; Composition: Metal Film,Thin Film; Voltage Rating (DC): 75V; Termination: SMD/SMT; Package Quantity: 1; Number of Terminations: 2; Military Standard: Not; Max Power Dissipation: 100mW; Features: Automotive AEC-Q200; Length: 1.6mm; Height: 0.45mm; Width: 0.8mm; Depth: 0.8mm; Radiation Hardening: No; REACH SVHC: No SVHC; Lead Free: Lead Free; ComponentLink1URL: https://datasheet.ciiva.com/9184/aoa0000ce26-9184949.pdf; ComponentLink1Description: https://datasheet.ciiva.com/9184/aoa0000ce26-9184949.pdf; ComponentLink2URL: https://datasheet.ciiva.com/16772/70068849-16772661.pdf; ComponentLink2Description: https://datasheet.ciiva.com/16772/70068849-16772661.pdf; ComponentLink3URL: https://datasheet.ciiva.com/16784/70068849-16784981.pdf; ComponentLink3Description: https://datasheet.ciiva.com/16784/70068849-16784981.pdf; ComponentLink4URL: https://datasheet.ciiva.com/11808/0900766b80fe20f7-11808022.pdf; ComponentLink4Description: https://datasheet.ciiva.com/11808/0900766b80fe20f7-11808022.pdf; ComponentLink5URL: https://datasheet.ciiva.com/5915/485442-5915161.pdf; ComponentLink5Description: https://datasheet.ciiva.com/5915/485442-5915161.pdf; ComponentLink6URL: https://datasheet.ciiva.com/48530/era-eng-tds-48530409.pdf; ComponentLink6Description: https://datasheet.ciiva.com/48530/era-eng-tds-48530409.pdf; ComponentLink7URL: https://datasheet.ciiva.com/5915/485442-5915162.pdf; ComponentLink7Description: https://datasheet.ciiva.com/5915/485442-5915162.pdf; ComponentLink8URL: https://datasheet.ciiva.com/48425/era-eng-tds-48425434.pdf; ComponentLink8Description: https://datasheet.ciiva.com/48425/era-eng-tds-48425434.pdf; ComponentLink9URL: https://datasheet.ciiva.com/5915/485442-5915163.pdf; ComponentLink9Description: https://datasheet.ciiva.com/5915/485442-5915163.pdf; ComponentLink10URL: https://datasheet.ciiva.com/22739/1776116-22739771.pdf; ComponentLink10Description: https://datasheet.ciiva.com/22739/1776116-22739771.pdf; ComponentLink11URL: https://datasheet.ciiva.com/43457/485442-43457755.pdf; ComponentLink11Description: https://datasheet.ciiva.com/43457/485442-43457755.pdf; ComponentLink12URL: https://datasheet.ciiva.com/30236/54aoa0000ce26-30236957.pdf; ComponentLink12Description: https://datasheet.ciiva.com/30236/54aoa0000ce26-30236957.pdf; ComponentLink13URL: https://datasheet.ciiva.com/9116/aoa0000ce26-9116670.pdf; ComponentLink13Description: https://datasheet.ciiva.com/9116/aoa0000ce26-9116670.pdf; ComponentLink14URL: https://datasheet.ciiva.com/17207/aoa0000ce26-17207198.pdf; ComponentLink14Description: https://datasheet.ciiva.com/17207/aoa0000ce26-17207198.pdf; ComponentLink15URL: https://datasheet.ciiva.com/29183/451748-da-01-en-widerstand-0603-era-29183884.pdf; ComponentLink15Description: https://datasheet.ciiva.com/29183/451748-da-01-en-widerstand-0603-era-29183884.pdf; Supplier Part Number 1: P180KDBCT-ND
R25 = ERJ-3EKF5602V: PANASONIC ELECTRONIC COMPONENTS         ERJ3EKF5602V.             SMD Chip Resistor, Thick Film, 56 kohm, 75 V, 0603 [1608 Metric], 100 mW,  1%, ERJ3E Series; Power Rating: 100mW; Voltage Rating: 75V; Temperature Coefficient: 100ppm/°C; Tolerance: 1%; Supplier 1: Digi-Key; Manufacturer: Panasonic; Manufacturer Part Number: ERJ-3EKF5602V; Stock 1: 563407; Pricing 1: 1=0.1, 10=0.079, 100=0.0323, 1000=0.01449, 2500=0.01258 (USD); Mount: Surface Mount; Case/Package: 0603; Number of Pins: 2; Case Code (Imperial): 0603; Case Code (Metric): 1608; Contact Plating: Tin; Min Operating Temperature: -55°C; Max Operating Temperature: 155°C; Packaging: Tape and Reel; Composition: Thick Film; Voltage Rating (DC): 75V; Package Quantity: 1; Termination: SMD/SMT; Number of Terminations: 2; Military Standard: Not; Max Power Dissipation: 100mW; Features: Automotive AEC-Q200; Length: 1.6mm; Height: 0.022inch; Width: 0.8mm; Depth: 0.8mm; Radiation Hardening: No; REACH SVHC: No SVHC; Lead Free: Lead Free; ComponentLink1URL: https://datasheet.ciiva.com/9188/aoa0000ce2-9188742.pdf; ComponentLink1Description: https://datasheet.ciiva.com/9188/aoa0000ce2-9188742.pdf; ComponentLink2URL: https://datasheet.ciiva.com/16757/70260748-16757718.pdf; ComponentLink2Description: https://datasheet.ciiva.com/16757/70260748-16757718.pdf; ComponentLink3URL: https://datasheet.ciiva.com/24069/aoa0000ce2-24069910.pdf; ComponentLink3Description: https://datasheet.ciiva.com/24069/aoa0000ce2-24069910.pdf; ComponentLink4URL: https://datasheet.ciiva.com/22684/1678782-22684791.pdf; ComponentLink4Description: https://datasheet.ciiva.com/22684/1678782-22684791.pdf; ComponentLink5URL: https://datasheet.ciiva.com/16514/aoa0000ce2-16514104.pdf; ComponentLink5Description: https://datasheet.ciiva.com/16514/aoa0000ce2-16514104.pdf; ComponentLink6URL: https://datasheet.ciiva.com/30089/aoa0000ce2-30089321.pdf; ComponentLink6Description: https://datasheet.ciiva.com/30089/aoa0000ce2-30089321.pdf; ComponentLink7URL: https://datasheet.ciiva.com/46373/1678782-46373897.pdf; ComponentLink7Description: https://datasheet.ciiva.com/46373/1678782-46373897.pdf; ComponentLink8URL: https://datasheet.ciiva.com/46373/1678782-46373898.pdf; ComponentLink8Description: https://datasheet.ciiva.com/46373/1678782-46373898.pdf; ComponentLink9URL: https://datasheet.ciiva.com/7886/aoa0000ce2-7886732.pdf; ComponentLink9Description: https://datasheet.ciiva.com/7886/aoa0000ce2-7886732.pdf; ComponentLink10URL: https://datasheet.ciiva.com/16765/70260748-16765709.pdf; ComponentLink10Description: https://datasheet.ciiva.com/16765/70260748-16765709.pdf; ComponentLink11URL: https://datasheet.ciiva.com/28590/1678782-28590957.pdf; ComponentLink11Description: https://datasheet.ciiva.com/28590/1678782-28590957.pdf; ComponentLink12URL: https://datasheet.ciiva.com/48531/aoa0000ce2-48531022.pdf; ComponentLink12Description: https://datasheet.ciiva.com/48531/aoa0000ce2-48531022.pdf; Supplier Part Number 1: P56.0KHDKR-ND
R26 = ERA-3AEB472V: Res Thin Film 0603 4.7K Ohm 0.1% 0.1W(1/10W) ±25ppm/C Molded SMD Automotive Punched T/R; Manufacturer: Panasonic; Power Rating: 100mW; Voltage Rating: 75V; Temperature Coefficient: 25ppm/°C; Tolerance: 0.1%; Supplier 1: Digi-Key; Manufacturer Part Number: ERA-3AEB472V; Stock 1: 123784; Pricing 1: 1=0.41, 10=0.346, 100=0.1351, 1000=0.05655, 2500=0.05184 (USD); Mount: Surface Mount; Case/Package: 0603; Number of Pins: 2; Case Code (Metric): 1608; Case Code (Imperial): 0603; Contact Plating: Tin; Min Operating Temperature: -55°C; Max Operating Temperature: 155°C; Packaging: Tape and Reel; Package Quantity: 5000; Termination: SMD/SMT; Max Power Dissipation: 100mW; Composition: Metal Film,Thin Film; Military Standard: Not; Voltage Rating (DC): 75V; Number of Terminations: 2; Working Voltage: 75V; Length: 1.6mm; Height: 0.45mm; Depth: 0.8mm; Width: 0.8mm; Radiation Hardening: No; REACH SVHC: No SVHC; Lead Free: Lead Free; ComponentLink1URL: https://datasheet.ciiva.com/22743/485442-22743061.pdf; ComponentLink1Description: https://datasheet.ciiva.com/22743/485442-22743061.pdf; ComponentLink2URL: https://datasheet.ciiva.com/46422/485442-46422693.pdf; ComponentLink2Description: https://datasheet.ciiva.com/46422/485442-46422693.pdf; ComponentLink3URL: https://datasheet.ciiva.com/11808/0900766b80fe20f7-11808039.pdf; ComponentLink3Description: https://datasheet.ciiva.com/11808/0900766b80fe20f7-11808039.pdf; ComponentLink4URL: https://datasheet.ciiva.com/9116/aoa0000ce26-9116681.pdf; ComponentLink4Description: https://datasheet.ciiva.com/9116/aoa0000ce26-9116681.pdf; ComponentLink5URL: https://datasheet.ciiva.com/22781/485442-22781497.pdf; ComponentLink5Description: https://datasheet.ciiva.com/22781/485442-22781497.pdf; ComponentLink6URL: https://datasheet.ciiva.com/9117/aoa0000ce26-9117707.pdf; ComponentLink6Description: https://datasheet.ciiva.com/9117/aoa0000ce26-9117707.pdf; ComponentLink7URL: https://datasheet.ciiva.com/43455/485442-43455227.pdf; ComponentLink7Description: https://datasheet.ciiva.com/43455/485442-43455227.pdf; ComponentLink8URL: https://datasheet.ciiva.com/16772/70068849-16772572.pdf; ComponentLink8Description: https://datasheet.ciiva.com/16772/70068849-16772572.pdf; ComponentLink9URL: https://datasheet.ciiva.com/48425/era-eng-tds-48425470.pdf; ComponentLink9Description: https://datasheet.ciiva.com/48425/era-eng-tds-48425470.pdf; ComponentLink10URL: https://datasheet.ciiva.com/30078/54aoa0000ce26-30078815.pdf; ComponentLink10Description: https://datasheet.ciiva.com/30078/54aoa0000ce26-30078815.pdf; ComponentLink11URL: https://datasheet.ciiva.com/29183/451124-da-01-en-widerstand-0603-era-29183789.pdf; ComponentLink11Description: https://datasheet.ciiva.com/29183/451124-da-01-en-widerstand-0603-era-29183789.pdf; Supplier Part Number 1: P4.7KDBDKR-ND
U1 = CMP-0111-00327-1: MachXO2 High Performance CPLD with 6864 LUTs, 1.2V, 144-pin TQFP, Speed Grade-4, Commercial Grade, Halogen Free (RoHS); Code_JEDEC: MS-026-BFB; PackageDescription: 144-Pin Thin Quad Flat Pack (TQFP144); PackageVersion: ver02.6, Nov-2010; DatasheetVersion: ver01.0, Nov-2010; PackageReference: TQFP144; PartId: 1
U2 = CMP-2000-06287-1: Dual High Speed USB to Multipurpose UART / FIFO IC / , 3 to 3.6 V, -40 to 85 degC, 64- Pin LQFP, RoHS; Manufacturer: FTDI; Number of Channels per Chip: 2; Standard Supported: RS232,RS422,RS485; Maximum Data Rate: 480Mbit/s; Package Description: 64-Pin Low-profile Quad Flat Package, Body 10 x 10 mm, Pitch 0.5 mm; Maximum Operating Temperature: +85°C; Mounting Technology: SurfaceMount; Pin Count: 64; Package Reference: LQFP-64; Manufacturer URL: http://www.nxp.com/; Length: 10mm; Width: 10mm; Minimum Operating Temperature: -40°C; Dimensions: 10x10x1.4mm; Package Type: LQFP; Mounting Type: SurfaceMount; Datasheet URL: http://www.ftdichip.com/Support/Documents/DataSheets/ICs/DS_FT2232H.pdf; Datasheet Version: Rev. 2.5, 07/2016; Height: 1.4mm; PartId: 1
U4 U5 = CMP-0323-00361-1: Buck Step Down Regulator with 2.3 to 6 V Input and 0.6 to 6 V Output, -40 to 85 degC, 6-Pin SON (DRV), Green (RoHS & no Sb/Br); Manufacturer: Texas Instruments; Iout(Max)(A): 1; Vout(Min)(V): 0.6; Synchronous Rectification: TRUE; Rating: Catalog; Vin(Max)(V): 6; Duty Cycle(Max)(%): 100; Switch Current Limit(Typ)(A): 1.4; Vin(Min)(V): 2.3; SubFamily: Step-Down Regulator; Iq(Typ)(mA): 0.015; ComponentLink1URL: http://www.ti.com/general/docs/lit/getliterature.tsp?genericPartNumber=TPS62290&fileType=pdf; Topology: Buck; PackageVersion: revE, Oct-2010; Eco-Plan: Green (RoHS & no Sb/Br); Mounting Technology: Surface Mount; PartNumber: TPS62290DRVR; Regulated Outputs(#): 1; Vout(Max)(V): 6; ComponentLink2URL: Samples URL:http://www.ti.com/product/tps62290#samples; DatasheetVersion: SLVS764C; ComponentLink1Description: Datasheet; PackageReference: DRV6-1600X1000TP; PackageDescription: 6-Pin Plastic Small Outline No-Lead, 2 x 2 x 0.8 mm Body, 0.65 mm Pitch, Exposed Pad; ComponentLink2Description: URL Link1
U6 = MIC2288YD5: Imported; Vendor: Microchip; Manufacturer_Part_Number: mic2288yd5; RefDes: RefDes; Type: DEV; Value: Value